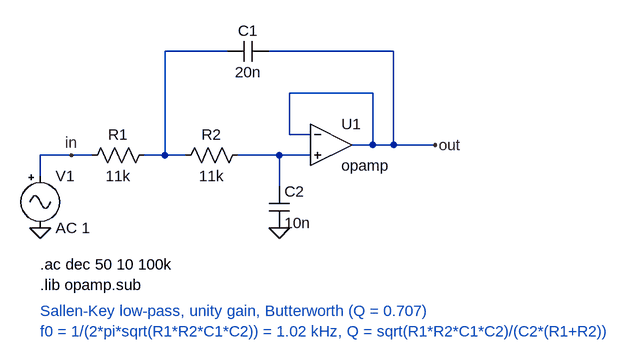
[diagram p0: schematic sallen_key_lowpass.asc]
sallen_key_lowpass.asc, the LTspice schematic file:
Version 4
SHEET 1 880 680
WIRE 224 -16 224 144
WIRE 320 -16 224 -16
WIRE 576 -16 384 -16
WIRE 576 128 576 -16
WIRE 416 48 416 112
WIRE 544 48 416 48
WIRE 544 128 544 48
WIRE 448 112 416 112
WIRE 32 144 32 176
WIRE 112 144 32 144
WIRE 256 144 192 144
WIRE 400 144 336 144
WIRE 448 144 400 144
WIRE 400 192 400 144
WIRE 640 128 512 128
FLAG 32 256 0
FLAG 400 256 0
FLAG 80 144 in
FLAG 640 128 out
SYMBOL Misc\signal 32 160 R0
SYMATTR InstName V1
SYMATTR Value AC 1
SYMBOL res 208 128 R90
WINDOW 0 0 56 VBottom 2
WINDOW 3 32 56 VTop 2
SYMATTR InstName R1
SYMATTR Value 11k
SYMBOL res 352 128 R90
WINDOW 0 0 56 VBottom 2
WINDOW 3 32 56 VTop 2
SYMATTR InstName R2
SYMATTR Value 11k
SYMBOL cap 384 -32 R90
WINDOW 0 0 32 VBottom 2
WINDOW 3 32 32 VTop 2
SYMATTR InstName C1
SYMATTR Value 20n
SYMBOL cap 384 192 R0
SYMATTR InstName C2
SYMATTR Value 10n
SYMBOL OpAmps\opamp 480 64 R0
SYMATTR InstName U1
TEXT 32 312 Left 2 !.ac dec 50 10 100k
TEXT 32 344 Left 2 !.lib opamp.sub
TEXT 32 384 Left 2 ;Sallen-Key low-pass, unity gain, Butterworth (Q = 0.707)\nf0 = 1/(2*pi*sqrt(R1*R2*C1*C2)) = 1.02 kHz, Q = sqrt(R1*R2*C1*C2)/(C2*(R1+R2))

The netlist it stands for:
* sallen_key_lowpass.asc
V1 in 0 AC 1
R1 N001 in 11k
R2 N002 N001 11k
C1 out N001 20n
C2 N002 0 10n
XU1 out N002 out opamp Aol=100K GBW=10Meg  ; pins invin noninvin out
.ac dec 50 10 100k
.lib opamp.sub
* Sallen-Key low-pass, unity gain, Butterworth (Q = 0.707)
* f0 = 1/(2*pi*sqrt(R1*R2*C1*C2)) = 1.02 kHz, Q = sqrt(R1*R2*C1*C2)/(C2*(R1+R2))
.backanno
.end